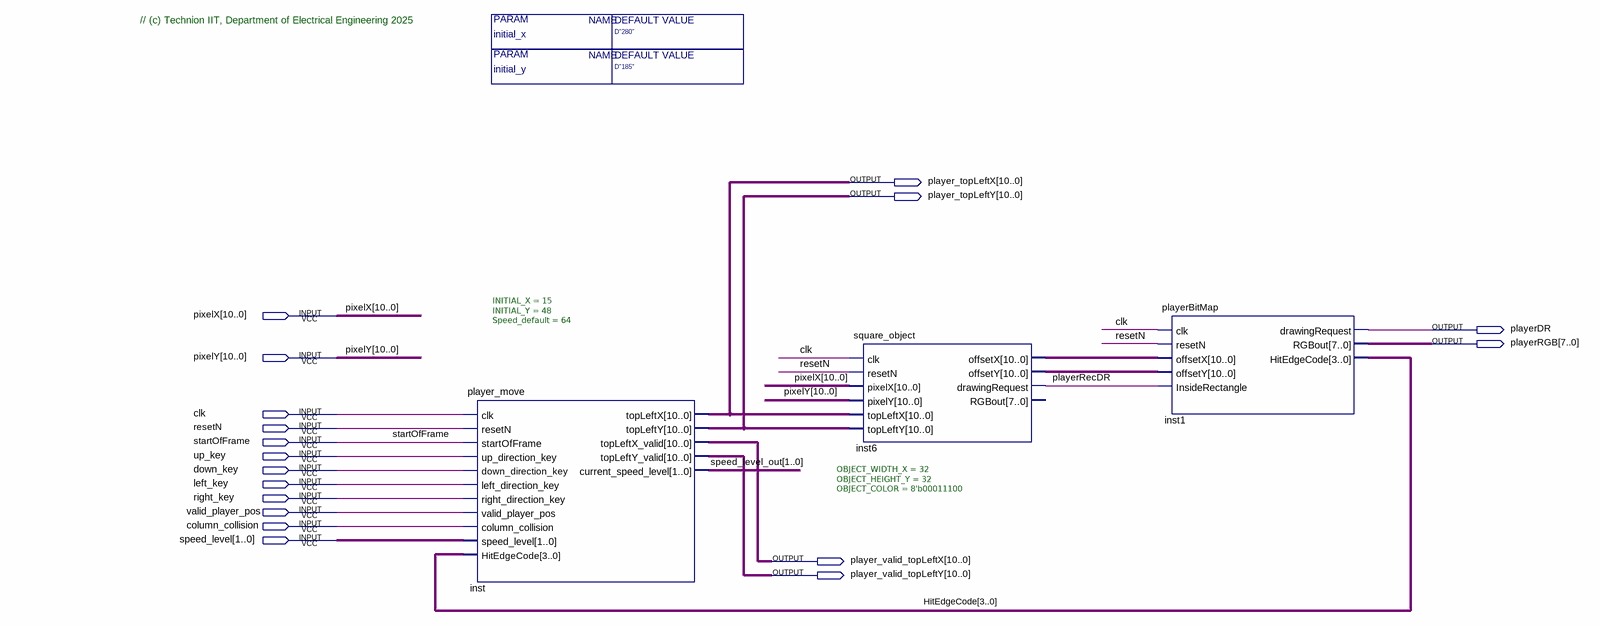
[diagram p0: schematic sheet]
// Quartus schematic Player_Block_T.bdf as structural Verilog: 3 symbols, 18 pins
module Player_Block_T #(parameter initial_x = "D\"280\"", parameter initial_y = "D\"185\"") (
  input  [10:0] pixelX,
  input  [10:0] pixelY,
  input  clk,
  input  resetN,
  input  startOfFrame,
  input  up_key,
  input  down_key,
  input  left_key,
  input  right_key,
  input  valid_player_pos,
  input  column_collision,
  input  [1:0] speed_level,
  output [10:0] player_topLeftX,
  output [10:0] player_topLeftY,
  output playerDR,
  output [7:0] playerRGB,
  output [10:0] player_valid_topLeftX,
  output [10:0] player_valid_topLeftY
);

  wire playerRecDR;
  wire [1:0] speed_level_out;
  wire [3:0] HitEdgeCode;
  wire [10:0] inst6_offsetx, inst6_offsety;

  player_move #(.INITIAL_X(15), .INITIAL_Y(48), .Speed_default(64)) inst (
    .clk(clk), .resetN(resetN), .startOfFrame(startOfFrame), .up_direction_key(up_key),
    .down_direction_key(down_key), .left_direction_key(left_key), .right_direction_key(right_key),
    .valid_player_pos(valid_player_pos), .column_collision(column_collision), .speed_level(speed_level),
    .HitEdgeCode(HitEdgeCode), .topLeftX(player_topLeftX), .topLeftY(player_topLeftY),
    .topLeftX_valid(player_valid_topLeftX), .topLeftY_valid(player_valid_topLeftY),
    .current_speed_level(speed_level_out));
  square_object #(.OBJECT_WIDTH_X(32), .OBJECT_HEIGHT_Y(32), .OBJECT_COLOR(8'b00011100)) inst6 (
    .clk(clk), .resetN(resetN), .pixelX(pixelX), .pixelY(pixelY), .topLeftX(player_topLeftX),
    .topLeftY(player_topLeftY), .offsetX(inst6_offsetx), .offsetY(inst6_offsety), .drawingRequest(playerRecDR));  // open: RGBout
  playerBitMap inst1 (
    .clk(clk), .resetN(resetN), .offsetX(inst6_offsetx), .offsetY(inst6_offsety),
    .InsideRectangle(playerRecDR), .drawingRequest(playerDR), .RGBout(playerRGB), .HitEdgeCode(HitEdgeCode));

  // Notes on the sheet:
  //   // (c) Technion IIT, Department of Electrical Engineering 2025
endmodule
